# EAGLE design piezoampdcsource (EAGLE 6.5.0)
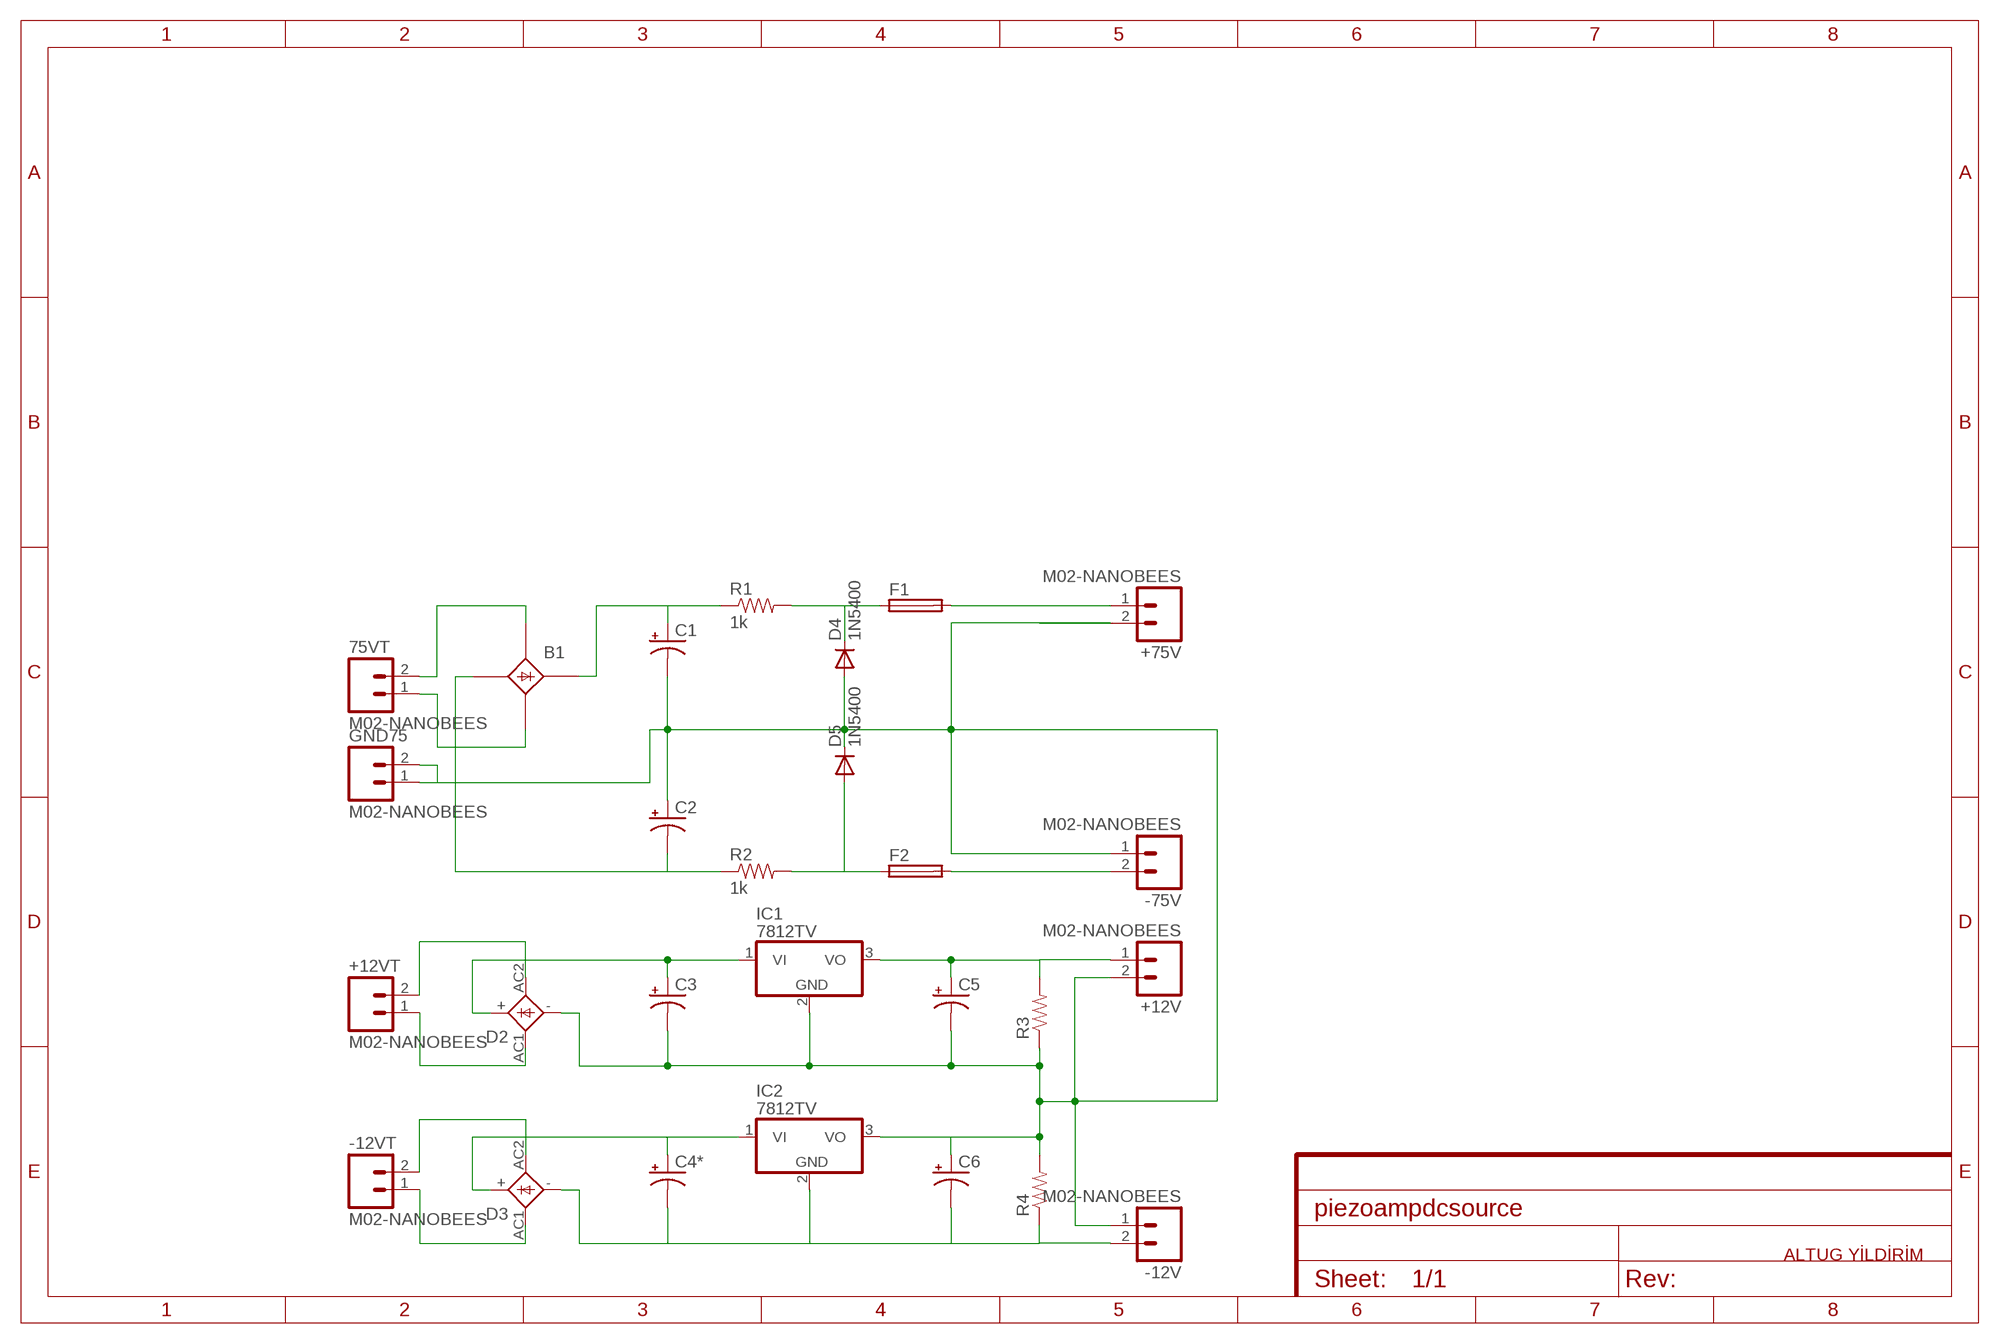
[diagram p0: schematic, sheet 1]

## Parts
75VT  M02-NANOBEES  [M02-NANOBEES]
+12V  M02-NANOBEES  [M02-NANOBEES]
+12VT  M02-NANOBEES  [M02-NANOBEES]
+75V  M02-NANOBEES  [M02-NANOBEES]
-12V  M02-NANOBEES  [M02-NANOBEES]
-12VT  M02-NANOBEES  [M02-NANOBEES]
-75V  M02-NANOBEES  [M02-NANOBEES]
B1  B25A-  [B25A-]
C1  CAP_POLPTH3  [CPOL-RADIAL-1000UF-63V]
C2  CAP_POLPTH3  [CPOL-RADIAL-1000UF-63V]
C3  CAP_POLPTH3  [CPOL-RADIAL-1000UF-63V]
C4*  CAP_POLPTH3  [CPOL-RADIAL-1000UF-63V]
C5  CAP_POLPTH2  [CPOL-RADIAL-10UF-25V]
C6  CAP_POLPTH2  [CPOL-RADIAL-10UF-25V]
D2  2KBP  [2KBP]
D3  2KBP  [2KBP]
D4  1N5400  [DO201-15]
D5  1N5400  [DO201-15]
F1  GSH15  [GSH15]
F2  GSH15  [GSH15]
GND75  M02-NANOBEES  [M02-NANOBEES]
IC1  7812TV  [TO220V]
IC2  7812TV  [TO220V]
R1  1k  1KOHM1/4W5%(PTH)HORIZ-KIT  [AXIAL-0.3EZ]
R2  1k  1KOHM1/4W5%(PTH)HORIZ-KIT  [AXIAL-0.3EZ]
R3  RESISTORAXIAL-0.3  [AXIAL-0.3]
R4  RESISTORAXIAL-0.3  [AXIAL-0.3]

## Nets
GND: +12V.2 +75V.2 -12V.1 -75V.1 C1.2(-) C2.1(+) C3.2(-) C5.2(-) C6.1(+) D2.- D4.A D5.C GND75.1 GND75.2 IC1.2(GND) IC2.3(VO) R3.P$1 R4.P$2
N$1: +12VT.2 D2.AC2
N$2: 75VT.2 B1.AC1-(AC1)
N$3: -12VT.2 D3.AC2
N$4: -12V.2 C4*.2(-) C6.2(-) D3.- IC2.2(GND) R4.P$1
N$6: C4*.1(+) D3.+ IC2.1(VI)
N$7: +12V.1 C5.1(+) IC1.3(VO) R3.P$2
N$8: +75V.1 F1.2
N$9: B1.+1(+) C1.1(+) R1.P$1
N$10: B1.-1(-) C2.2(-) R2.P$1
N$11: -75V.2 F2.2
N$12: D4.C F1.1 R1.P$2
N$13: D5.A F2.1 R2.P$2
N$14: +12VT.1 D2.AC1
N$16: 75VT.1 B1.AC2-(AC2)
N$18: -12VT.1 D3.AC1
N$19: C3.1(+) D2.+ IC1.1(VI)
Unconnected: B1.+ B1.- B1.AC1 B1.AC2

## Notes on the sheet
- ALTUG YİLDİRİM

## Library data of the parts
75VT +12V +12VT +75V -12V -12VT -75V GND75 = SparkFun-Connectors:M02-NANOBEES
B1 = rectifier_nanobees:B25A-: RECTIFIER 25-A bridge
C1-C3 C4* C5 C6 = SparkFun-Capacitors:CAP_POL: Capacitor Polarized These are standard SMD and PTH capacitors. Normally 10uF, 47uF, and 100uF in electrolytic and tantalum varieties. Always verify the external diameter of the through hole cap, it varies with capacity, voltage, and manufacturer. The EIA devices should be standard.
D2 D3 = rectifier:2KBP: RECTIFIER grid 3 x 3,81 mm
D4 D5 = diode:1N5400: DIODE standard rectifier, 3 A, 50 V (Motorola)
F1 F2 = fuse:GSH15: FUSE HOLDER grid 15mm, 19649 Wickmann; MPN: 64900001039; OC_FARNELL: 1271673; OC_NEWARK: 02P0318
IC1 IC2 = linear:78*: Positive VOLTAGE REGULATOR Source: http://cache.national.com/ds/LM/LM78L05.pdf http://www.fairchildsemi.com/ds/LM/LM7805.pdf
R1 R2 = SparkFun-Resistors:1KOHM1/4W5%(PTH): RES-08380; PROD_ID: RES-08380
R3 R4 = SparkFun-Resistors:RESISTOR: Resistor Basic schematic elements and footprints for 0603, 1206, and PTH resistors.

## Board
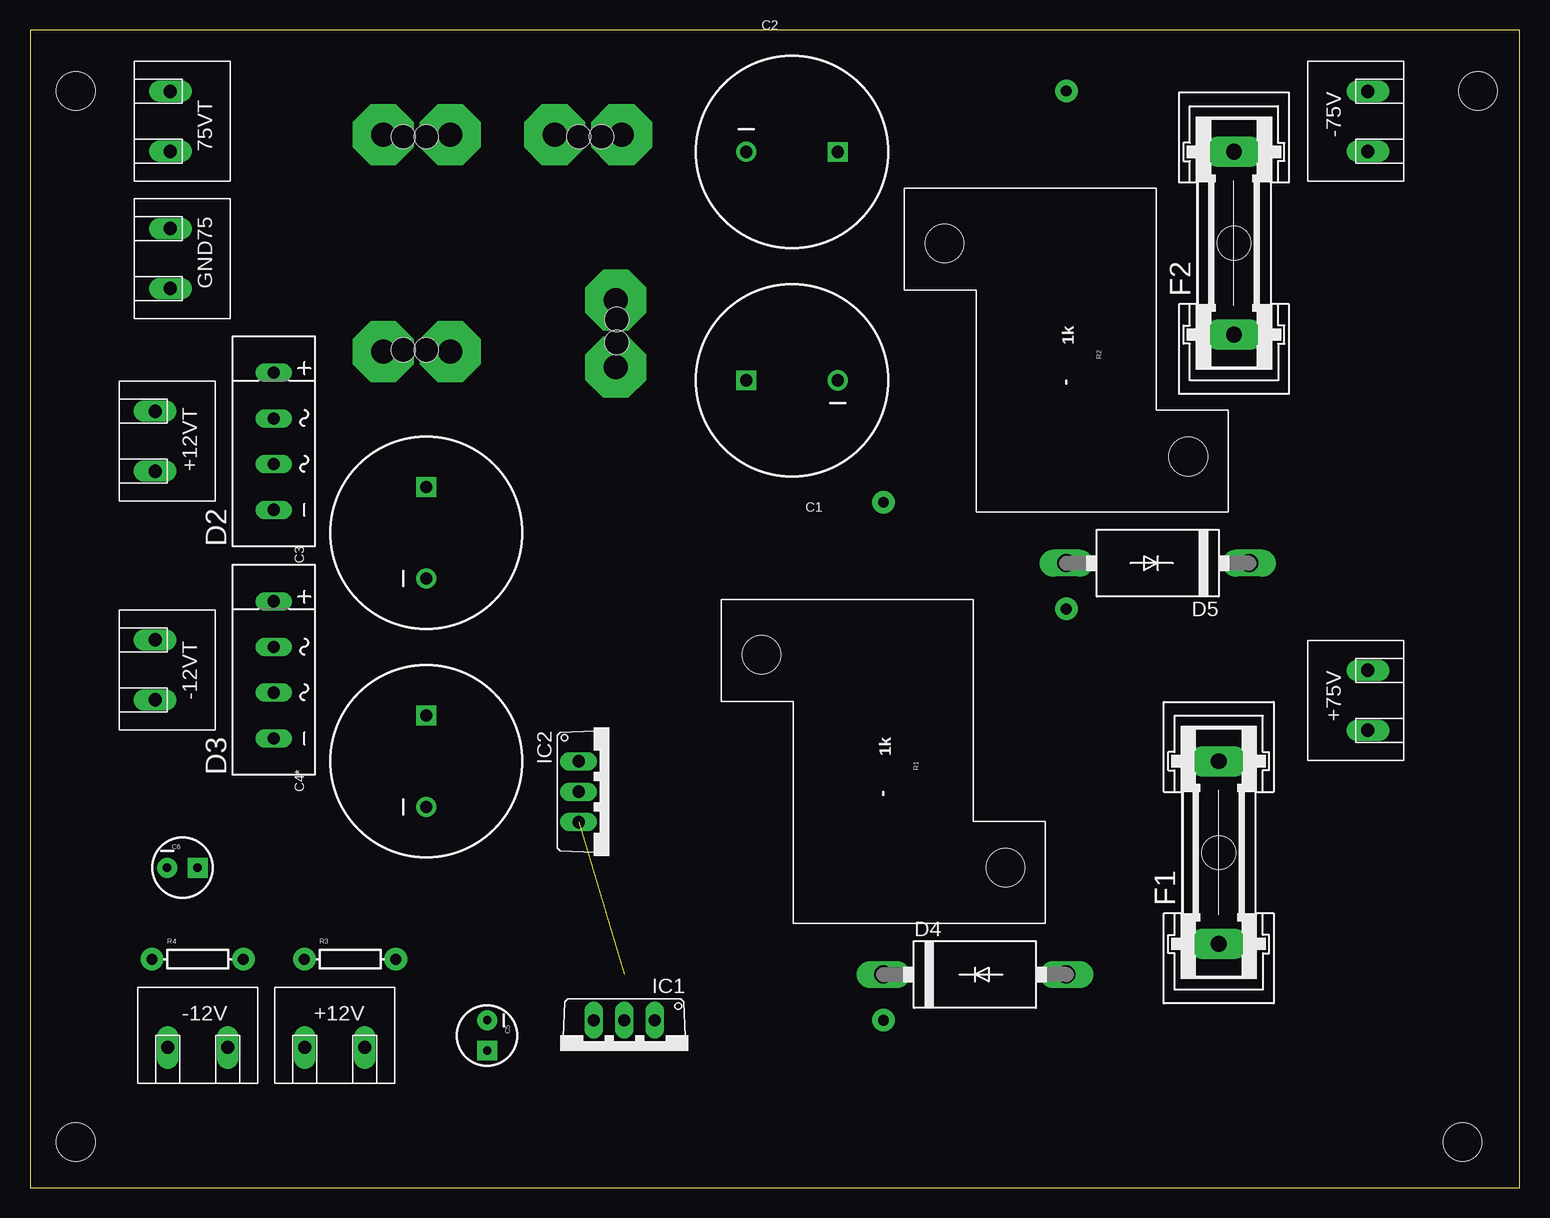
[diagram p1: board, top side]
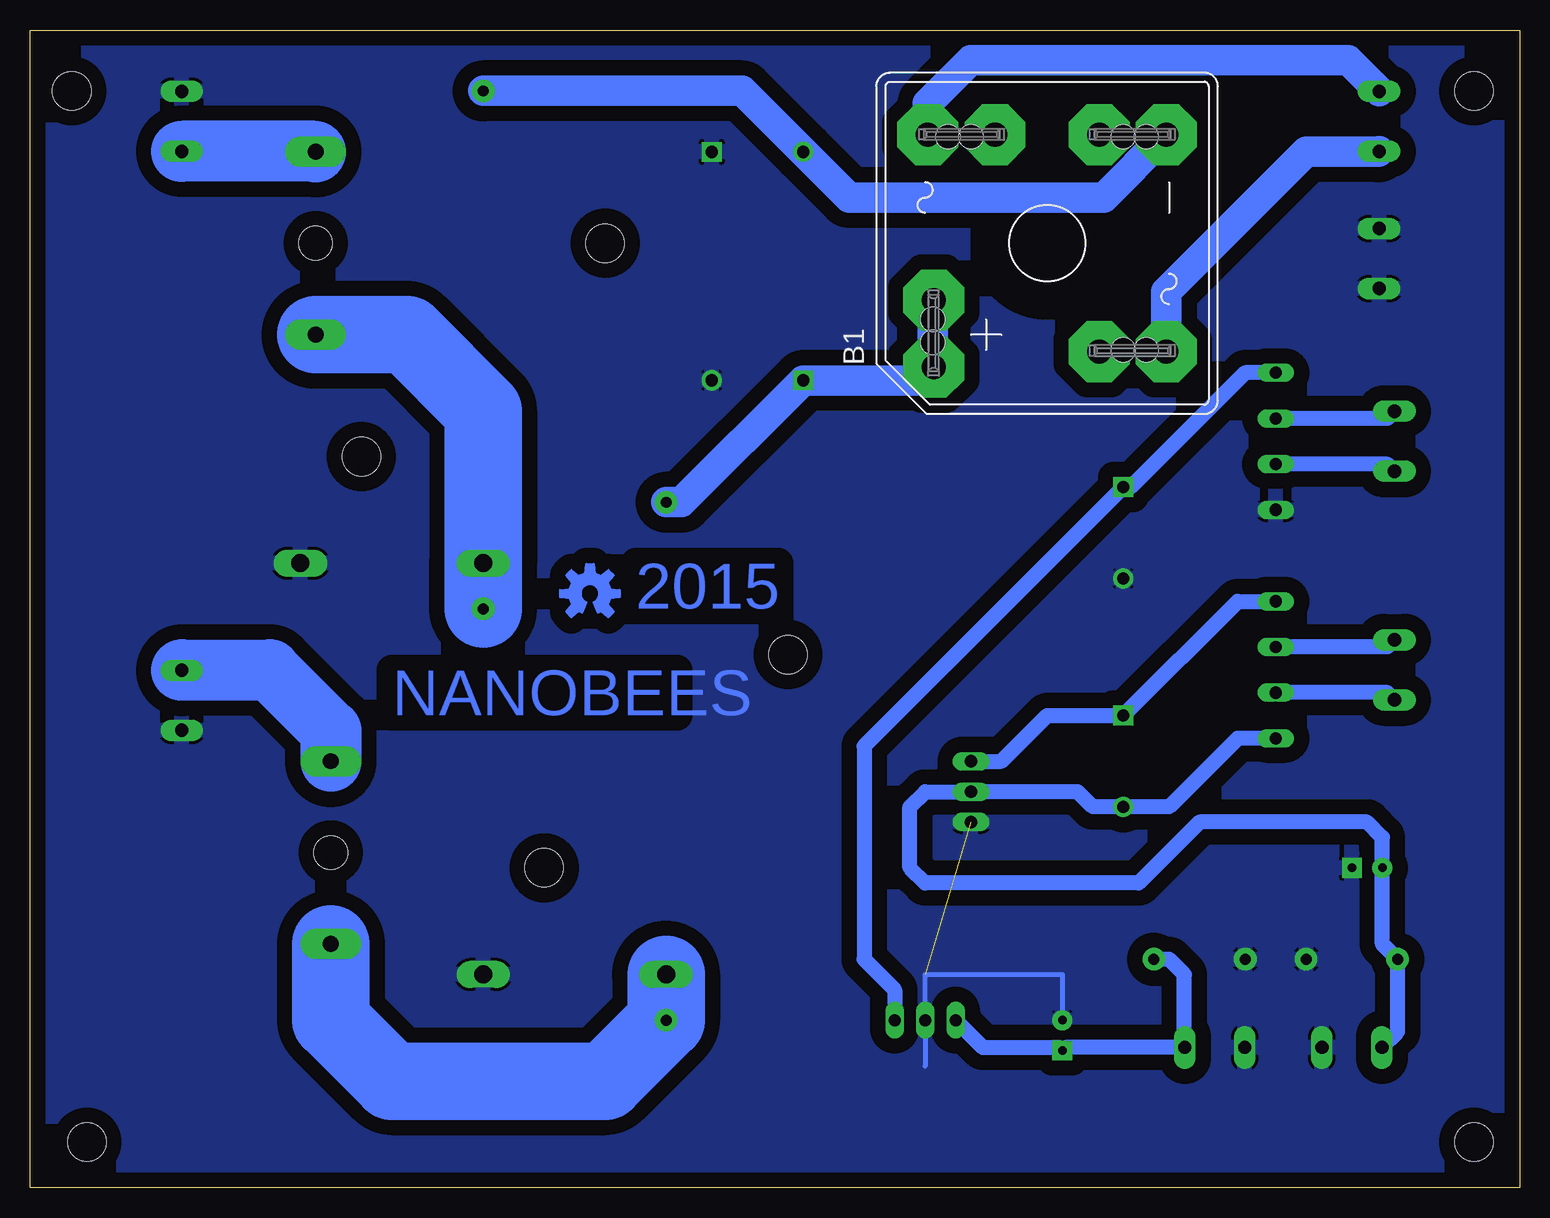
[diagram p2: board, bottom side, seen from below]

Size 124.13 x 96.51 mm. Coordinates in mm from the lower left corner, seen from the top.
Outline: 0,0 124.13,0 124.13,96.51 0,96.51 0,0
Copper layers (1*16): Top 0.035mm / dielectric 1.5mm / Bottom 0.035mm
Design rules "default": minimum track width 10mil, minimum drill 24mil, track to track 8mil, track to pad 8mil, pad to pad 8mil, via to via 8mil, smd to smd 8mil, copper to edge 40mil, drill to drill 8mil, minimum pad ring 10mil, minimum via ring 8mil, stop-mask expansion 4mil, vias tented up to drill 0mil, thermal gap 10mil
Holes 3.2 mm at 3.81,91.44 3.81,3.81 119.38,3.81 120.65,91.44

### Footprints (pad centres in the part's own frame; a part is rotated, then mirrored left to right if it is on the bottom)
M02-NANOBEES = drill 1.1 pad 1.778 long: 1 -2.5,1; 2 2.5,1
B25A- = drill 2.007 pad 5.08 octagon: + -10.338,9.449; +1 -4.75,9.449; - 9.042,-4.343; -1 9.042,-9.931; AC1 9.042,4.343; AC1- 9.042,9.931; AC2 -9.042,-4.343; AC2- -9.042,-9.931 | hole 2: -8.255,9.525; -6.35,9.525; 8.89,-6.35; 8.89,-8.255; -8.89,-6.35; -8.89,-8.255; 8.89,8.255; 8.89,6.35
CPOL-RADIAL-1000UF-63V = drill 1.016 pad 1.651 square: 1 3.81,0 | drill 1.016 pad 1.676: 2 -3.81,0
CPOL-RADIAL-10UF-25V = drill 0.7 pad 1.651 square: 1 1.27,0 | drill 0.7 pad 1.651: 2 -1.27,0
2KBP = drill 1.016 long: + 5.715,0; - -5.715,0; AC1 -1.905,0; AC2 1.905,0
DO201-15 = drill 1.499 long: A 7.62,0; C -7.62,0
GSH15 = drill 1.321 pad 2.54 long: 1 -7.62,0; 2 7.62,0 | hole 2.794: 0,0
TO220V = drill 1.016 long: 1 -2.54,-2.54; 2 0,-2.54; 3 2.54,-2.54
AXIAL-0.3EZ = drill 0.9 pad 1.88: P$1 -21.59,0; P$2 21.59,0 | hole 3.2: 8.89,10.16; -8.89,-10.16
AXIAL-0.3 = drill 0.9 pad 1.88: P$1 -3.81,0; P$2 3.81,0

### Placement (x,y rotation side)
75VT  12.7,88.9 90 top
+12V  25.4,12.7 180 top
+12VT  11.43,62.23 90 top
+75V  110.49,40.64 270 top
-12V  13.97,12.7 180 top
-12VT  11.43,43.18 90 top
-75V  110.49,88.9 270 top
B1  39.37,78.74 90 bottom
C1  63.5,67.31 180 top
C2  63.5,86.36 0 top
C3  33.02,54.61 90 top
C4*  33.02,35.56 90 top
C5  38.1,12.7 270 top
C6  12.7,26.67 0 top
D2  20.32,62.23 90 top
D3  20.32,43.18 90 top
D4  78.74,17.78 0 top
D5  93.98,52.07 180 top
F1  99.06,27.94 90 top
F2  100.33,78.74 90 top
GND75  12.7,77.47 90 top
IC1  49.53,11.43 180 top
IC2  48.26,33.02 270 top
R1  71.12,35.56 270 top
R2  86.36,69.85 270 top
R3  26.67,19.05 0 top
R4  13.97,19.05 0 top
U$1  [OSHW-LOGO-M]  77.47,49.53 0 top

### Tracks (layer width: path | path; a pad name or v marks a point on that pad's centre or on a via)
GND  (1 unrouted)
  Bottom 0.406: 49.53,10.16 IC1.2 49.53,17.78 38.1,17.78 C5.2
  pour Bottom (isolate 1.27): -1.27,0 -1.27,96.52 123.19,96.52 123.19,0
N$1
  Bottom 1.27: D2.AC2 11.03,64.14 +12VT.2
N$2
  Bottom 2.54: 75VT.2 14.28,93.98 45.72,93.98 49.3,90.4 B1.AC1-
N$3
  Bottom 1.27: D3.AC2 11.03,45.08 -12VT.2
N$4
  Bottom 1.27: -12V.2 10.16,13.01 R4.P$1 11.43,20.32 C6.2 11.43,29.21 12.7,30.48 26.67,30.48 31.75,25.4 49.53,25.4 50.8,26.67 50.8,31.75 49.53,33.02 IC2.2 36.83,33.02 35.56,31.75 C4*.2 29.21,31.75 23.5,37.47 D3.-
N$6
  Bottom 1.27: IC2.1 43.18,35.56 39.37,39.37 C4*.1 23.5,48.89 D3.+
N$7
  Bottom 1.27: IC1.3 44.72,11.7 38.37,11.7 C5.1 37.83,11.7 +12V.1 27.94,11.74 27.94,17.78 29.21,19.05 R3.P$2
N$8
  Bottom 5.08: +75V.1 111.45,43.18 104.14,43.18 99.06,38.1 F1.2
N$9
  Bottom 2.54: B1.+1 48.89,73.91 48.89,67.94 49.53,67.31 C1.1 69.85,57.15 R1.P$1
N$10
  Bottom 2.54: B1.-1 34.67,82.55 55.88,82.55 C2.2 64.77,91.44 R2.P$1
N$11
  Bottom 5.08: F2.2 100.37,86.4 -75V.2
N$12
  Bottom 6.452: D4.C R1.P$2 76.2,8.89 93.98,8.89 99.06,13.97 F1.1
N$13
  Bottom 6.452: R2.P$2 D5.A 86.36,64.77 92.71,71.12 F2.1
N$14
  Bottom 1.27: D2.AC1 11.03,60.33 +12VT.1
N$16
  Bottom 2.54: 75VT.1 11.74,86.36 17.78,86.36 29.44,74.7 B1.AC2-
N$18
  Bottom 1.27: D3.AC1 11.03,41.27 -12VT.1
N$19
  Bottom 1.27: D2.+ 22.86,67.94 32.39,58.42 C3.1 54.61,36.83 54.61,19.05 52.07,16.51 IC1.1

### Text on the board
Bottom: 2015 | NANOBEES